# Altium schematic sheet USB Upstream.SchDoc
size 297 x 209 mm; CompanyName: Sainsbury Wellcome Centre; Organization: FabLab; Address1: Sainsbury Wellcome Centre; Address2: 25 Howland Street; Address3: London; Address4: W1T 4JG; DocumentNumber: 4; SheetNumber: 4; SheetTotal: 14; swcgroup: FabLab; Org: Sainsbury Wellcome Centre; Add1: 25 Howland Street; Add2: London; Add3: W1T 4JG; WebAddress: www.sainsburywellcome.org; SheetSize: A4; SheetName: USB Upstream
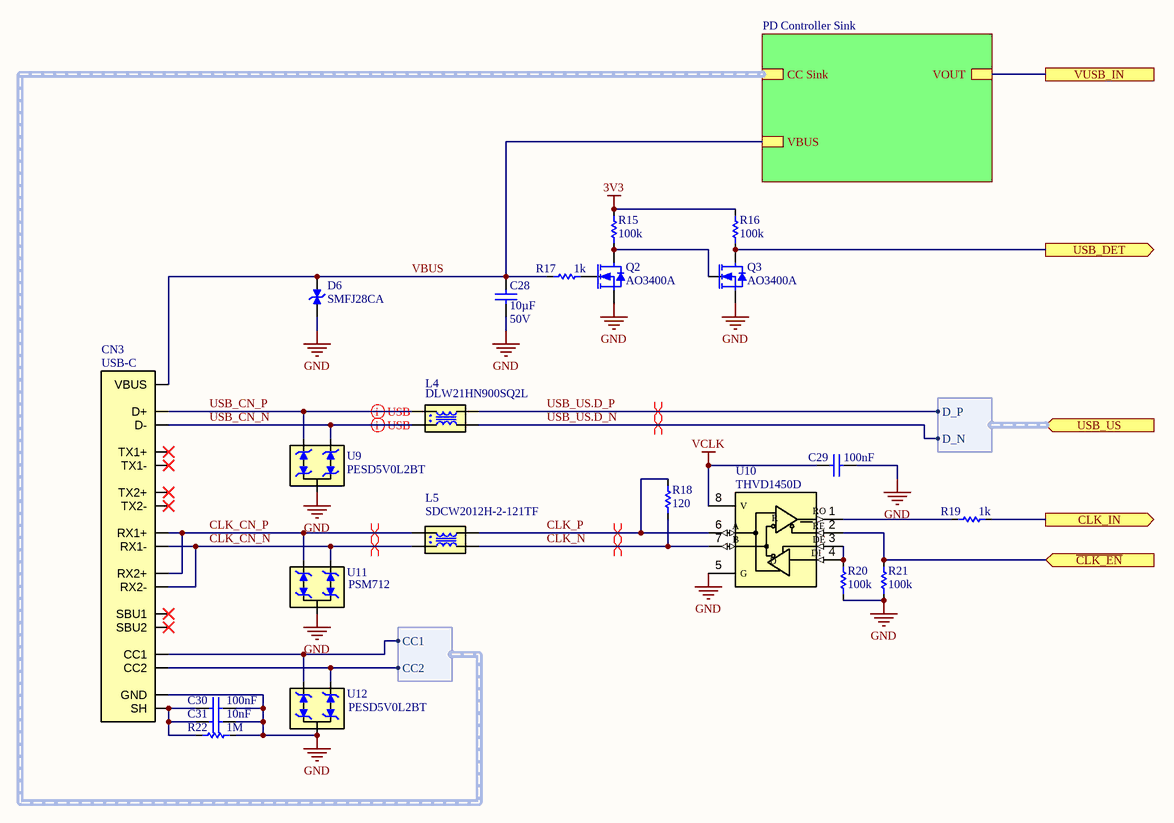
[diagram p0: USB Upstream.SchDoc]

## Parts
C28  value 10µF  Voltage Rating: 50V  [CAP_CHIP_0805]  (hidden comment: C0805-10uF-50V)
C29  value 100nF  [CAP_CHIP_0603]  (hidden comment: C0603-100nF-50V)
C30  value 100nF  [CAP_CHIP_0603]  (hidden comment: C0603-100nF-50V)
C31  value 10nF  [CAP_CHIP_0603]  (hidden comment: C0603-10nF-50V)
CN3  USB-C  [TYPEC-24P]
D6  SMFJ28CA  [SOD123]
L4  PartNumber: DLW21HN900SQ2L  [IND_CHOKE_0805]  (hidden comment: CHOKE-90R)
L5  PartNumber: SDCW2012H-2-121TF  [IND_CHOKE_0805]  (hidden comment: CHOKE-120R)
Q2  AO3400A  [SOT23]
Q3  AO3400A  [SOT23]
R15  value 100k  [RES_CHIP_0603]  (hidden comment: R0603-100K)
R16  value 100k  [RES_CHIP_0603]  (hidden comment: R0603-100K)
R17  value 1k  [RES_CHIP_0603]  (hidden comment: R0603-1K)
R18  value 120  [RES_CHIP_0603]  (hidden comment: R0603-120R)
R19  value 1k  [RES_CHIP_0603]  (hidden comment: R0603-1K)
R20  value 100k  [RES_CHIP_0603]  (hidden comment: R0603-100K)
R21  value 100k  [RES_CHIP_0603]  (hidden comment: R0603-100K)
R22  value 1M  [RES_CHIP_0603]  (hidden comment: R0603-1M)
U9  PESD5V0L2BT  [SOT23]
U10  THVD1450D  [VSSOP8_3X3_0.65E]
U11  PSM712  [SOT23]
U12  PESD5V0L2BT  [SOT23]

## Sub-sheets
PD Controller Sink = PD Controller Sink.SchDoc: CC Sink (harness CC Sink), VOUT, VBUS

## Ports
CLK_IN (out), USB_DET (out), USB_US (in, harness USB_US), VUSB_IN, ~{CLK_EN} (in)

## Harnesses
USB_US: D_P, D_N
CC Sink: CC2, CC1

## Nets
3V3: R15.1 R16.1
GND: C28.1 C29.1 C30.1 C31.1 CN3.A1,_A12,_B1,_B12(GND) D6.1(K) Q2.2(S) Q3.2(S) R20.1 R21.1 R22.1 U9.3(COM) U10.5(G) U11.3(COM) U12.3(COM)
VCLK: C29.2 U10.8(V)
~{CLK_EN}: R21.2 U10.2(~{RE}) ; port ~{CLK_EN}
CLK_CN_N: CN3.A10(RX2-) CN3.B10(RX1-) L5.4 U11.2(ANODE)
CLK_CN_P: CN3.A11(RX2+) CN3.B11(RX1+) L5.1 U11.1(ANODE)
CLK_IN: R19.2 ; port CLK_IN
CLK_N: L5.3 R18.1 U10.7(B)
CLK_P: L5.2 R18.2 U10.6(A)
USB_CN_N: CN3.A7,_B7(D-) L4.1 U9.1(ANODE)
USB_CN_P: CN3.A6,_B6(D+) L4.4 U9.2(ANODE)
USB_DET: Q3.3(D) R16.2 ; port USB_DET
USB_US.D_N: L4.2 ; port USB_US.D_N
USB_US.D_P: L4.3 ; port USB_US.D_P
VBUS: C28.2 CN3.A4,_A9,_B4,_B9(VBUS) D6.2(A) R17.1 ; sheet PD Controller Sink/VBUS
VUSB_IN: port VUSB_IN, sheet PD Controller Sink/VOUT
NetC30_2: C30.2 C31.2 CN3.0(SH) R22.2
NetCN3_A5: CN3.A5(CC1) U12.1(ANODE) ; sheet PD Controller Sink/CC Sink.CC1
NetCN3_B5: CN3.B5(CC2) U12.2(ANODE) ; sheet PD Controller Sink/CC Sink.CC2
NetQ2_1: Q2.1(G) R17.2
NetQ2_3: Q2.3(D) Q3.1(G) R15.2
NetR19_1: R19.1 U10.1(RO)
NetR20_2: R20.2 U10.3(DE) U10.4(D)

Not connected (* = marked no-connect by the designer): CN3 A2(TX1+)* A3(TX1-)* A8(SBU1)* B2(TX2+)* B3(TX2-)* B8(SBU2)*

## Layout directives
differential pair; differential pair class RS485: CLK_CN_N, CLK_CN_P, CLK_N, CLK_P
differential pair; differential pair class USB: USB_CN_N, USB_CN_P, USB_US.D_N, USB_US.D_P

## Notes on the sheet
- FILE
- VARIANT
- DATE
- REVISION
- SHEET
- /
- PROJECT
- SIZE
- (in symbol CMP-930-0015-1) R; RE; DI

## Library data of the parts
C28 = CMP-611-0042-4: 0805 Multilayer Ceramic Capacitors MLCC; PartNumber: GRM21BR61H106KE43L; Pick&PlaceFootprint: C0805; Tolerance: 10%; Dielectric: X5R; Capacitor Type: Ceramic; Mount: SMD; LCSC Part N.: C440198; Case/Package: 0805; RoHS: Yes
C29 = CMP-611-0027-24: 0603 Multilayer Ceramic Capacitors MLCC; PartNumber: CC0603KRX7R9BB104; Tolerance: 10%; Pick&PlaceFootprint: C0603; Dielectric: X7R; Voltage Rating: 50V; Capacitor Type: Ceramic; RoHS: Yes; Mount: SMD; LCSC Part N.: C14663; Case/Package: 0603
C30 = CMP-611-0027-24: 0603 Multilayer Ceramic Capacitors MLCC; PartNumber: CC0603KRX7R9BB104; Voltage Rating: 50V; Pick&PlaceFootprint: C0603; Dielectric: X7R; Tolerance: 10%; LCSC Part N.: C14663; Capacitor Type: Ceramic; Case/Package: 0603; RoHS: Yes; Mount: SMD
C31 = CMP-611-0022-7: 0603 Multilayer Ceramic Capacitors MLCC; PartNumber: 0603B103K500NT; Tolerance: 10%; Voltage Rating: 50V; Dielectric: X7R; Pick&PlaceFootprint: C0603; Capacitor Type: Ceramic; Mount: SMD; Case/Package: 0603; LCSC Part N.: C57112; RoHS: Yes
CN3 = CMP-340-0003-10: USB 3.1 5A 1 260℃ Surface Mount，Right Angle 24P Female -45℃~+85℃ Type-C SMD USB Connectors; pin to pad: S1>G1+G2+G3+G4+G5+G6; PartNumber: TYPEC-324G-BCP24; Current Rating: 5A; Mount: Surface Mount; LCSC Part N.: C920230; Orientation: Horizontal; Gender: Female
D6 = CMP-210-0002-1: 4.4A 45.4V@4.4A 200W 31.1V Bi-Directional 28V SOD-123F Electrostatic and Surge Protection (TVS/ESD); Breakdown Voltage: 31V; Clamp Voltage: 45.4V; PartNumber: SMFJ28CA; Stand-off Voltage: 28V; Pick&PlaceFootprint: SOD-123; Mount: Surface Mount; LCSC Part N.: C5125651
L4 = CMP-600-0002-3: Data Line Filter, 2 Function(s), 50V, 0.33A, 4 Pin(s); DC Resistance-Max: 350mR; Insulation Resistance-Min: 10MR; Current Rating: 330mA; Output Impedance: 90R; Channels: 2; LCSC Part N.: C80529; Voltage Rating: 50V
L5 = CMP-600-0007-1: Data Line Filter, 2 Function(s), 20V, 0.28A, 4 Pin(s); Output Impedance: 120R; Current Rating: 280mA; DC Resistance-Max: 400mR; Insulation Resistance-Min: 10kR; Channels: 2; LCSC Part N.: C370248; Voltage Rating: 20V
Q2 Q3 = CMP-810-0002-2: 30V 5.7A 26.5mΩ@10V,5.7A 1.4W 1.5V@250uA 1 NChannel SOT-23-3L MOSFETs; Gate-Source Voltage (Vgs): 12V; Pick&PlaceFootprint: SOT-23; RDS(ON): 26.5mR; Switching Time: 34.5ns; LCSC Part N.: C20917; Drain-Source Voltage (Vds): 30V; Mount: Surface Mount; PartNumber: AO3400A; Power Dissipation: 1.4W; Drain Current (Id): 5.7A; Polarity: N Channel
R15 R16 R20 R21 = CMP-633-0000-28: 100mW Thick Film Resistors 75V ±100ppm/℃ ±1% 0603 Chip Resistor; PartNumber: 0603WAF1003T5E; Number of Resistors: 1; Pick&PlaceFootprint: R0603; LCSC Part N.: C25803; Mount: Surface Mount; Voltage Rating: 75V; Power Rating: 100mW; Case/Package: 0603; Tolerance: 1%
R17 R19 = CMP-633-0013-26: 100mW Thick Film Resistors 75V ±100ppm/℃ ±1% 0603 Chip Resistor; PartNumber: 0603WAF1001T5E; Pick&PlaceFootprint: R0603; Number of Resistors: 1; Voltage Rating: 75V; Case/Package: 0603; Tolerance: 1%; Mount: Surface Mount; LCSC Part N.: C21190; Power Rating: 100mW
R18 = CMP-633-0100-12: 100mW Thick Film Resistors 75V ±100ppm/℃ ±1% 0603 Chip Resistor; PartNumber: 0603WAF1200T5E; Pick&PlaceFootprint: R0603; Number of Resistors: 1; Mount: Surface Mount; Tolerance: 1%; Voltage Rating: 75V; Case/Package: 0603; Power Rating: 100mW; LCSC Part N.: C22787
R22 = CMP-633-0066-20: 100mW Thick Film Resistors 75V ±100ppm/℃ ±1% 0603 Chip Resistor; PartNumber: 0603WAF1004T5E; Pick&PlaceFootprint: R0603; Number of Resistors: 1; Mount: Surface Mount; Case/Package: 0603; Voltage Rating: 75V; LCSC Part N.: C22935; Power Rating: 100mW; Tolerance: 1%
U9 U12 = CMP-210-0005-2: Low capacitance double bidirectional ESD protection diodes in SOT23; Pick&PlaceFootprint: SOT-23; Stand-off Voltage: 5V; Breakdown Voltage: 7.5V; Clamp Voltage: 10V; PartNumber: PESD5V0L2BT; LCSC Part N.: C2858724
U10 = CMP-930-0015-1: 3.3-V to 5-V RS-485 transceiver with ±18-kV IEC ESD protection 8-VSSOP -40 to 125; PartNumber: THVD1450DGKR; Simplex/Duplex: Half Duplex; Data Rate: 50Mbps; Max Supply Voltage: 5V; Min Supply Voltage: 3.3V; LCSC Part N.: C2860896
U11 = CMP-210-0000-4: 19V 13.3V 12V SOT-23 Electrostatic and Surge Protection (TVS/ESD); PartNumber: PSM712-LF-T7; LCSC Part N.: C32677; Stand-off Voltage: 12V; Pick&PlaceFootprint: SOT-23; Breakdown Voltage: 13.3V; Clamp Voltage: 19V; Mount: Surface Mount